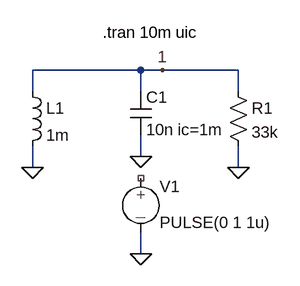
[diagram p0: schematic rlc.asc]
rlc.asc, the LTspice schematic file:
Version 4
SHEET 1 880 680
WIRE 208 80 48 80
WIRE 240 80 208 80
WIRE 352 80 240 80
WIRE 48 112 48 80
WIRE 208 112 208 80
WIRE 352 112 352 80
WIRE 208 208 208 176
WIRE 48 224 48 192
WIRE 352 224 352 192
WIRE 208 352 208 320
FLAG 48 224 0
FLAG 208 352 0
FLAG 352 224 0
FLAG 240 80 1
FLAG 208 208 0
SYMBOL ind 32 96 R0
SYMATTR InstName L1
SYMATTR Value 1m
SYMBOL cap 192 112 R0
SYMATTR InstName C1
SYMATTR Value 10n ic=1m
SYMBOL res 336 96 R0
SYMATTR InstName R1
SYMATTR Value 33k
SYMBOL source-V 208 224 R0
WINDOW 123 0 0 Left 2
WINDOW 39 0 0 Left 2
SYMATTR InstName V1
SYMATTR Value PULSE(0 1 1u)
TEXT 152 24 Left 2 !.tran 10m uic

The netlist it stands for:
* rlc.asc
L1 1 0 1m
C1 1 0 10n ic=1m
R1 1 0 33k
V1 NC_01 0 PULSE(0 1 1u)
.tran 10m uic
.backanno
.end